# Altium schematic sheet Jacks.SchDoc
size A4; SheetNumber: 1; SheetTotal: 1
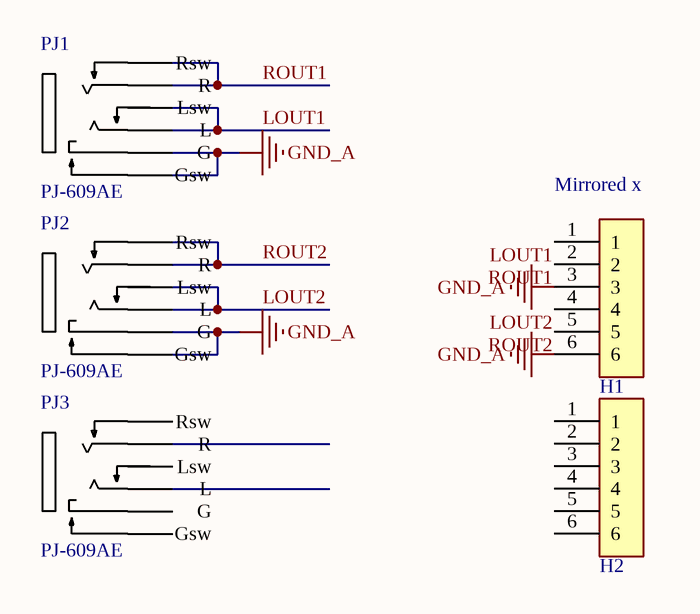
[diagram p0: Jacks.SchDoc]

## Parts
H1  1.5-6A  [1.5-6A]  (value not drawn)
H2  1.5-6A  [1.5-6A]  (value not drawn)
PJ1  PJ-609AE  [PJ609AE]
PJ2  PJ-609AE  [PJ609AE]
PJ3  PJ-609AE  [PJ609AE]

## Nets
GND_A: H1.3 H1.6 PJ1.2(G) PJ1.3(Gsw) PJ2.2(G) PJ2.3(Gsw)
LOUT1: H1.1 PJ1.6(L) PJ1.7(Lsw)
LOUT2: H1.4 PJ2.6(L) PJ2.7(Lsw)
ROUT1: H1.2 PJ1.4(R) PJ1.5(Rsw)
ROUT2: H1.5 PJ2.4(R) PJ2.5(Rsw)

Not connected (* = marked no-connect by the designer): H2 1 2 3 4 5 6; PJ3 2(G) 3(Gsw) 4(R) 5(Rsw) 6(L) 7(Lsw)

## Notes on the sheet
- (near H1) Mirrored x

## Library data of the parts
H1 H2 = 1.5-6A: Pin Header p=1.5mm, 6 pins
PJ1-PJ3 = PJ-609AE: 6.3mm jack HOOYA